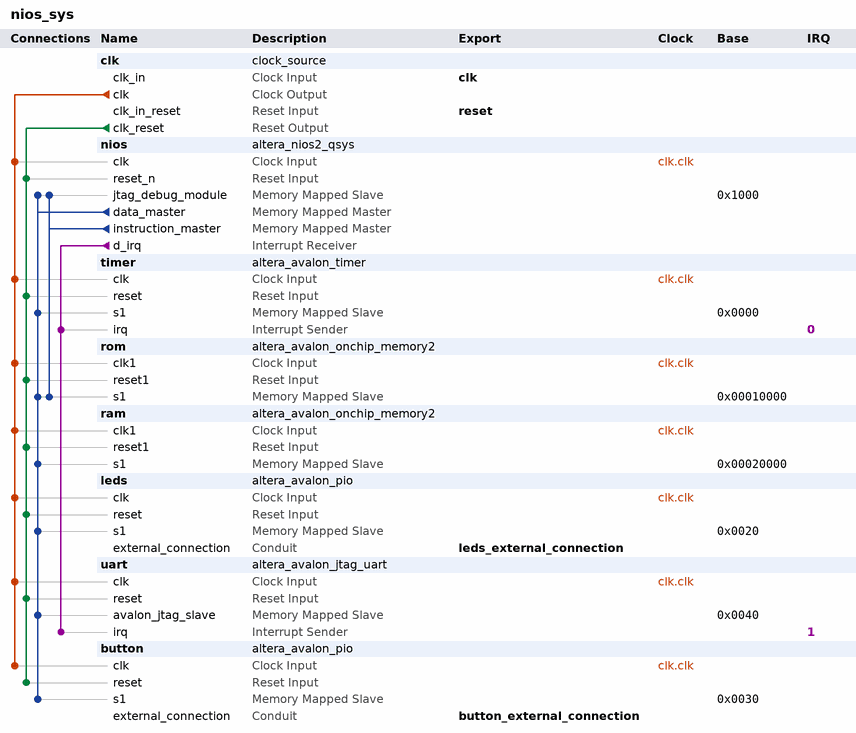
[diagram p0: system contents]
# Platform Designer (Qsys) system nios_sys, Cyclone IV E EP4CE6E22C8
# Parameters at their usual value, and those the tool derives, are not listed.
package require -exact qsys 13.0.1.99.2
create_system nios_sys
set_project_property DEVICE_FAMILY {Cyclone IV E}
set_project_property DEVICE EP4CE6E22C8

add_instance clk clock_source 13.0
set_instance_parameter_value clk clockFrequency 70000000

add_instance nios altera_nios2_qsys 13.0
set_instance_parameter_value nios resetSlave rom.s1
set_instance_parameter_value nios exceptionSlave rom.s1
set_instance_parameter_value nios breakSlave nios.jtag_debug_module
set_instance_parameter_value nios muldiv_multiplierType NoneSmall
set_instance_parameter_value nios impl Small
set_instance_parameter_value nios icache_size 512
set_instance_parameter_value nios icache_burstType Sequential
set_instance_parameter_value nios dcache_size 0

add_instance timer altera_avalon_timer 13.0.1.99.2
set_instance_parameter_value timer period 1
set_instance_parameter_value timer periodUnits SEC

add_instance rom altera_avalon_onchip_memory2 13.0.1.99.2
set_instance_parameter_value rom dataWidth 32
set_instance_parameter_value rom dualPort false
set_instance_parameter_value rom initMemContent true
set_instance_parameter_value rom initializationFileName rom
set_instance_parameter_value rom memorySize 16384
set_instance_parameter_value rom writable false

add_instance ram altera_avalon_onchip_memory2 13.0.1.99.2
set_instance_parameter_value ram dataWidth 32
set_instance_parameter_value ram dualPort false
set_instance_parameter_value ram initMemContent true
set_instance_parameter_value ram initializationFileName ram
set_instance_parameter_value ram memorySize 6144

add_instance leds altera_avalon_pio 13.0.1.99.2
set_instance_parameter_value leds direction Output
set_instance_parameter_value leds width 8

add_instance uart altera_avalon_jtag_uart 13.0.1.99.2
set_instance_parameter_value uart simInteractiveOptions INTERACTIVE_ASCII_OUTPUT

add_instance button altera_avalon_pio 13.0.1.99.2
set_instance_parameter_value button direction Input
set_instance_parameter_value button simDoTestBenchWiring true
set_instance_parameter_value button width 1

# connections
add_connection clk.clk button.clk clock
add_connection clk.clk leds.clk clock
add_connection clk.clk nios.clk clock
add_connection clk.clk ram.clk1 clock
add_connection clk.clk rom.clk1 clock
add_connection clk.clk timer.clk clock
add_connection clk.clk uart.clk clock
add_connection clk.clk_reset button.reset reset
add_connection clk.clk_reset leds.reset reset
add_connection clk.clk_reset nios.reset_n reset
add_connection clk.clk_reset ram.reset1 reset
add_connection clk.clk_reset rom.reset1 reset
add_connection clk.clk_reset timer.reset reset
add_connection clk.clk_reset uart.reset reset
add_connection nios.data_master button.s1 avalon
set_connection_parameter_value nios.data_master/button.s1 baseAddress 0x0030
add_connection nios.data_master leds.s1 avalon
set_connection_parameter_value nios.data_master/leds.s1 baseAddress 0x0020
add_connection nios.data_master nios.jtag_debug_module avalon
set_connection_parameter_value nios.data_master/nios.jtag_debug_module baseAddress 0x1000
add_connection nios.data_master ram.s1 avalon
set_connection_parameter_value nios.data_master/ram.s1 baseAddress 0x00020000
add_connection nios.data_master rom.s1 avalon
set_connection_parameter_value nios.data_master/rom.s1 baseAddress 0x00010000
add_connection nios.data_master timer.s1 avalon
set_connection_parameter_value nios.data_master/timer.s1 baseAddress 0x0000
add_connection nios.data_master uart.avalon_jtag_slave avalon
set_connection_parameter_value nios.data_master/uart.avalon_jtag_slave baseAddress 0x0040
add_connection nios.instruction_master nios.jtag_debug_module avalon
set_connection_parameter_value nios.instruction_master/nios.jtag_debug_module baseAddress 0x1000
add_connection nios.instruction_master rom.s1 avalon
set_connection_parameter_value nios.instruction_master/rom.s1 baseAddress 0x00010000
add_connection nios.d_irq timer.irq interrupt
set_connection_parameter_value nios.d_irq/timer.irq irqNumber 0
add_connection nios.d_irq uart.irq interrupt
set_connection_parameter_value nios.d_irq/uart.irq irqNumber 1

# exported interfaces
add_interface button_external_connection conduit end
set_interface_property button_external_connection EXPORT_OF button.external_connection
add_interface clk clock sink
set_interface_property clk EXPORT_OF clk.clk_in
add_interface leds_external_connection conduit end
set_interface_property leds_external_connection EXPORT_OF leds.external_connection
add_interface reset reset sink
set_interface_property reset EXPORT_OF clk.clk_in_reset

set_interconnect_requirement {$system} qsys_mm.clockCrossingAdapter HANDSHAKE
set_interconnect_requirement {$system} qsys_mm.maxAdditionalLatency 1

save_system nios_sys.qsys
